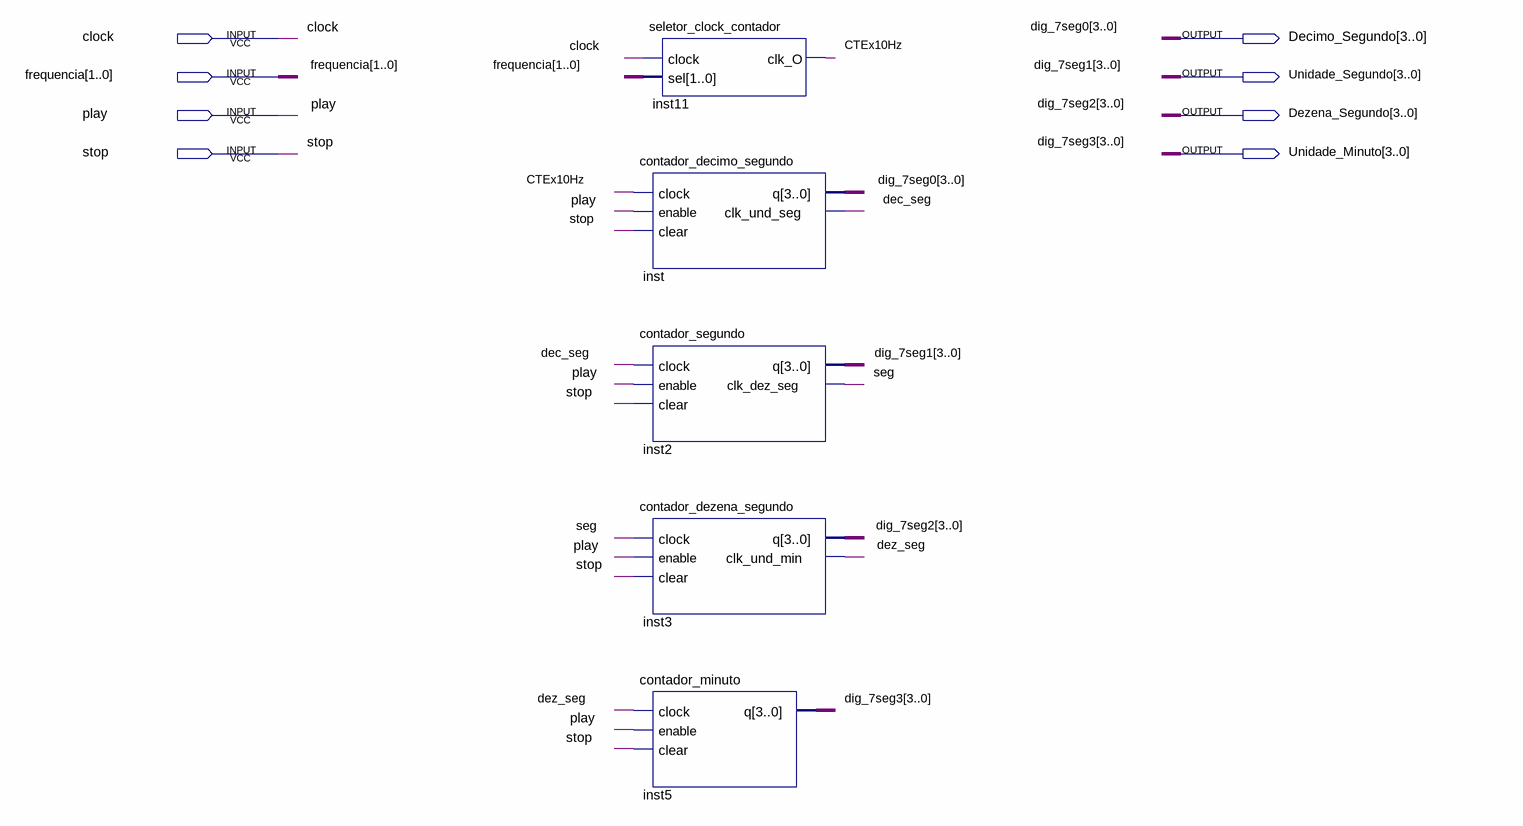
[diagram p0: schematic sheet]
// Quartus schematic contador_bloco.bdf as structural Verilog: 5 symbols, 8 pins
module contador_bloco (
  input  clock,
  input  [1:0] frequencia,
  input  play,
  input  stop,
  output [3:0] Decimo_Segundo,
  output [3:0] Unidade_Segundo,
  output [3:0] Dezena_Segundo,
  output [3:0] Unidade_Minuto
);

  wire CTEx10Hz, dec_seg, dez_seg, seg;

  seletor_clock_contador inst11 (.clock(clock), .sel(frequencia), .clk_O(CTEx10Hz));
  contador_decimo_segundo inst (
    .clock(CTEx10Hz), .enable(play), .clear(stop), .q(Decimo_Segundo), .clk_und_seg(dec_seg));
  contador_segundo inst2 (.clock(dec_seg), .enable(play), .clear(stop), .q(Unidade_Segundo), .clk_dez_seg(seg));
  contador_dezena_segundo inst3 (.clock(seg), .enable(play), .clear(stop), .q(Dezena_Segundo), .clk_und_min(dez_seg));
  contador_minuto inst5 (.clock(dez_seg), .enable(play), .clear(stop), .q(Unidade_Minuto));

  // Other names for the same wires on the sheet: dig_7seg0[3:0] = Decimo_Segundo; dig_7seg1[3:0] = Unidade_Segundo;
  //   dig_7seg2[3:0] = Dezena_Segundo; dig_7seg3[3:0] = Unidade_Minuto
endmodule
